# EAGLE design dps-swd-bottle-v1 (EAGLE 8.2.2)
CNAME: Pogo pin SWD adapter for the DPS; CREVISION: 1; DESIGNER: Johan Kanflo
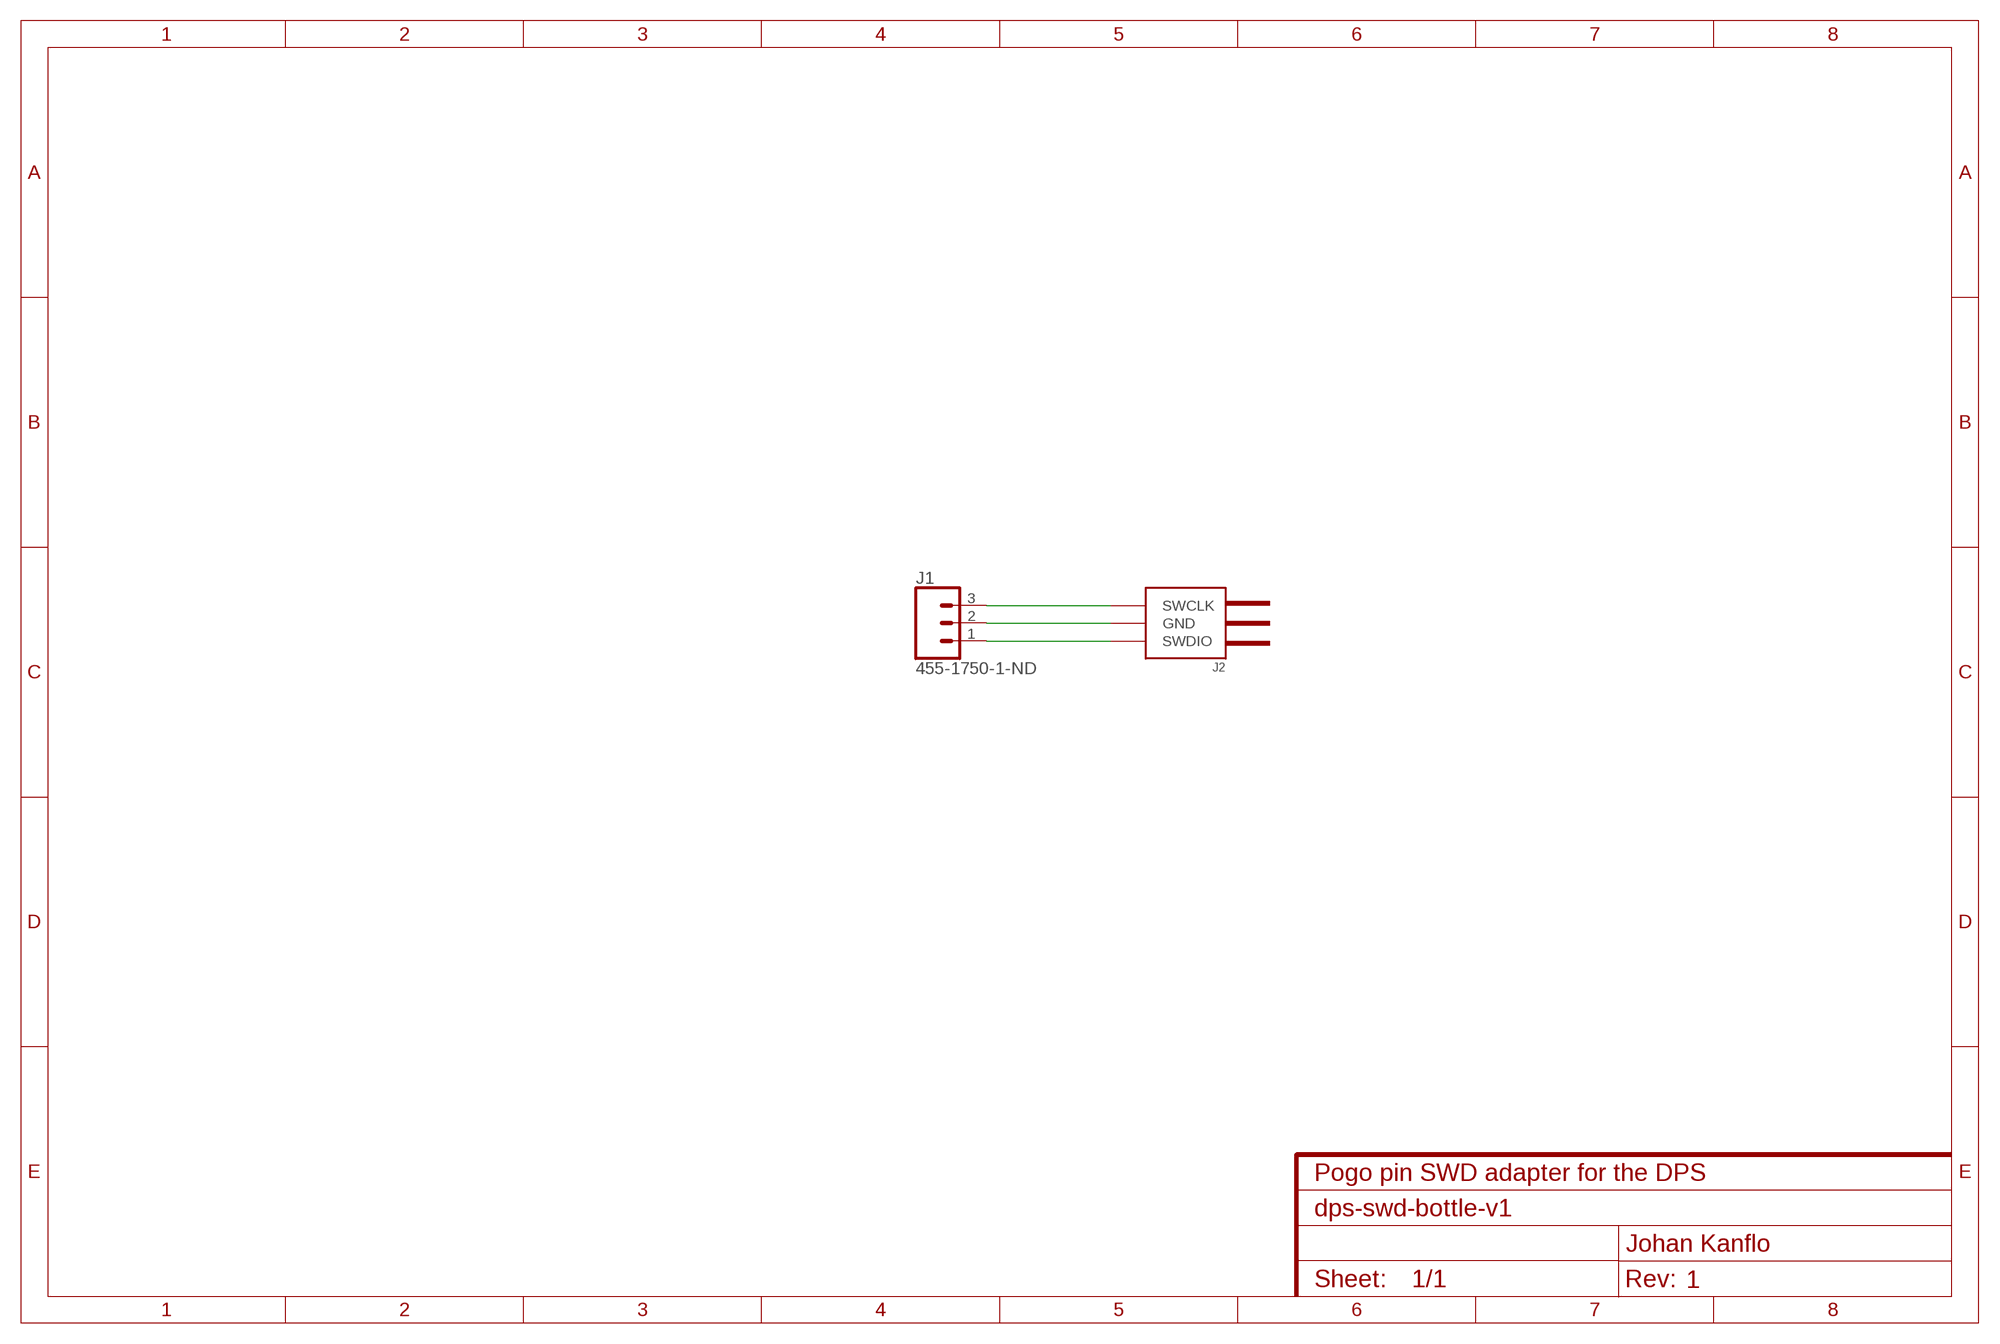
[diagram p0: schematic, sheet 1]

## Parts
J1  455-1750-1-ND  CONN_03  [1X03]
J2  DPS-SWD-PINS  [DPS-SWD-PINS]

## Nets
GND: J1.2 J2.GND
N$1: J1.3 J2.SWCLK
N$3: J1.1 J2.SWDIO

## Library data of the parts
J1 = SparkFun-Connectors:CONN_03: Multi connection point. Often used as Generic Header-pin footprint for 0.1 inch spaced/style header connections On any of the 0.1 inch spaced packages, you can populate with these: Break Away Headers - Straight <https://www.sparkfun.com/products/116> (PRT-00116) Break Away Male Headers - Right Angle <https://www.sparkfun.com/products/553> (PRT-00553) Female Headers <https://www.sparkfun.com/products/115> (PRT-00115) Break Away Headers - Machine Pin <https://www.sparkfun.com/products/117> (PRT-00117) Break Away Female Headers - Swiss Machine Pin <https://www.sparkfun.com/products/743> (PRT-00743) Stackable Header - 3 Pin (Female, 0.1") <https://www.sparkfun.com/products/13875> (PRT-13875) For SCREWTERMINALS and SPRING TERMINALS visit here: Screw Terimnals on SparkFun.com <https://www.sparkfun.com/search/results?term=Screw+Terminals> (5mm/3.5mm/2.54mm spacing) This device is also useful as a general connection point to wire up your design to another part of your project. Our various solder wires solder well into these plated through hole pads. Hook-Up Wire - Assortment (Stranded, 22 AWG) <https://www.sparkfun.com/products/11375> (PRT-11375) Hook-Up Wire - Assortment (Solid Core, 22 AWG) <https://www.sparkfun.com/products/11367> (PRT-11367) View the entire wire category on our website here <https://www.sparkfun.com/categories/141> Special notes: Molex polarized connector foot print use with SKU : PRT-08232 with associated crimp pins and housings.; PROD_ID: XXX-00000
J2 = kanflo:DPS-SWD-PINS: An SWD adapter board for the DPS5005 and friends. Solder three pogo pins of type P50-E2 (0.68mm in diameter) to the exposed pads and press against the right hand side of the SWD test points.

## Board
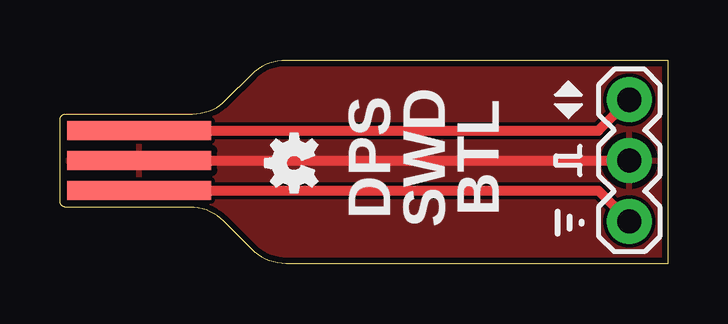
[diagram p1: board, top side]
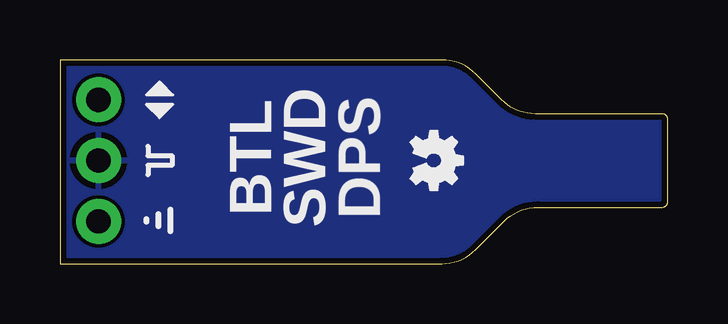
[diagram p2: board, bottom side, seen from below]

Size 25.35 x 8.5 mm. Coordinates in mm from the lower left corner, seen from the top.
Outline: 5.42,2.35 0.25,2.35 arc-90 0,2.6 0,6 arc-90 0.25,6.25 5.52,6.25 arc45 6.94,6.84 8.01,7.91 arc-45 9.43,8.5 25.35,8.5 25.35,0 9.43,0 arc-45 8.01,0.59 6.84,1.76 arc45 5.42,2.35
Copper layers (1*16): Top 0.035mm / dielectric 1.5mm / Bottom 0.035mm
Design rules "current": minimum track width 6mil, minimum drill 12mil, track to track 6mil, track to pad 6mil, pad to pad 6mil, via to via 6mil, smd to smd 0mil, copper to edge 10mil, drill to drill 10mil, minimum pad ring 10mil, minimum via ring 6mil, stop-mask expansion 2mil, vias tented up to drill 100mil, thermal gap 10mil

### Footprints (pad centres in the part's own frame; a part is rotated, then mirrored left to right if it is on the bottom)
1X03 = drill 1.016 pad 1.88: 1 0,0; 2 2.54,0; 3 5.08,0
DPS-SWD-PINS = smd 6 x 0.8: GND 0,0; SWCLK 0,-1.25; SWDIO 0,1.25

### Placement (x,y rotation side)
J1  23.74,6.84 270 top
J2  3.31,4.3 0 top
U$1  [SYM-GND]  21.2,1.76 90 top
U$2  [SYM-DOUBLE_ARROW]  21.2,6.84 90 top
U$3  [SYM-CLOCK]  21.2,4.3 90 top
U$4  [SYM-DOUBLE_ARROW]  21.2,6.84 270 bottom
U$5  [SYM-GND]  21.2,1.76 270 bottom
U$6  [OSHW-LOGO-MINI]  9.75,4.3 270 bottom
U$7  [SYM-CLOCK]  21.2,4.3 270 bottom
U$8  [OSHW-LOGO-MINI]  9.75,4.2 90 top

### Tracks (layer width: path | path; a pad name or v marks a point on that pad's centre or on a via)
GND
  Top 0.406: J2.GND J1.2
  pour Top: 25.35,8.5 9.35,8.5 8.6,8.25 8,7.8 7.1,6.9 6.6,6.4 6.1,6.2 5.5,6.2 0.2,6.2 0.1,6.1 0.1,2.6 0.1,2.5 0.3,2.4 5.9,2.4 6.4,2.2 7.2,1.6 7.7,1 8.2,0.5 8.7,0.2 9.2,0.1 12.4,0.1 25.3,0.1 25.4,0.1 25.4,8.5
  pour Bottom: 25.3,8.5 9.3,8.5 8.9,8.3 8.3,8.1 6.8,6.6 6.4,6.4 5.9,6.2 0.2,6.2 0.1,6.1 0.1,2.6 0.2,2.4 5.7,2.4 6.2,2.3 6.5,2.1 6.9,1.8 7.7,1 8.3,0.5 8.8,0.2 9.2,0.1 10,0.1 25.3,0.1
N$1
  Top 0.406: J2.SWCLK 22.45,3.05 J1.3
N$3
  Top 0.406: J2.SWDIO 22.45,5.55 J1.1

### Text on the board
tNames: DPS | SWD | BTL
bNames: DPS | SWD | BTL